# EAGLE schematic sprite (EAGLE 6.6.0)
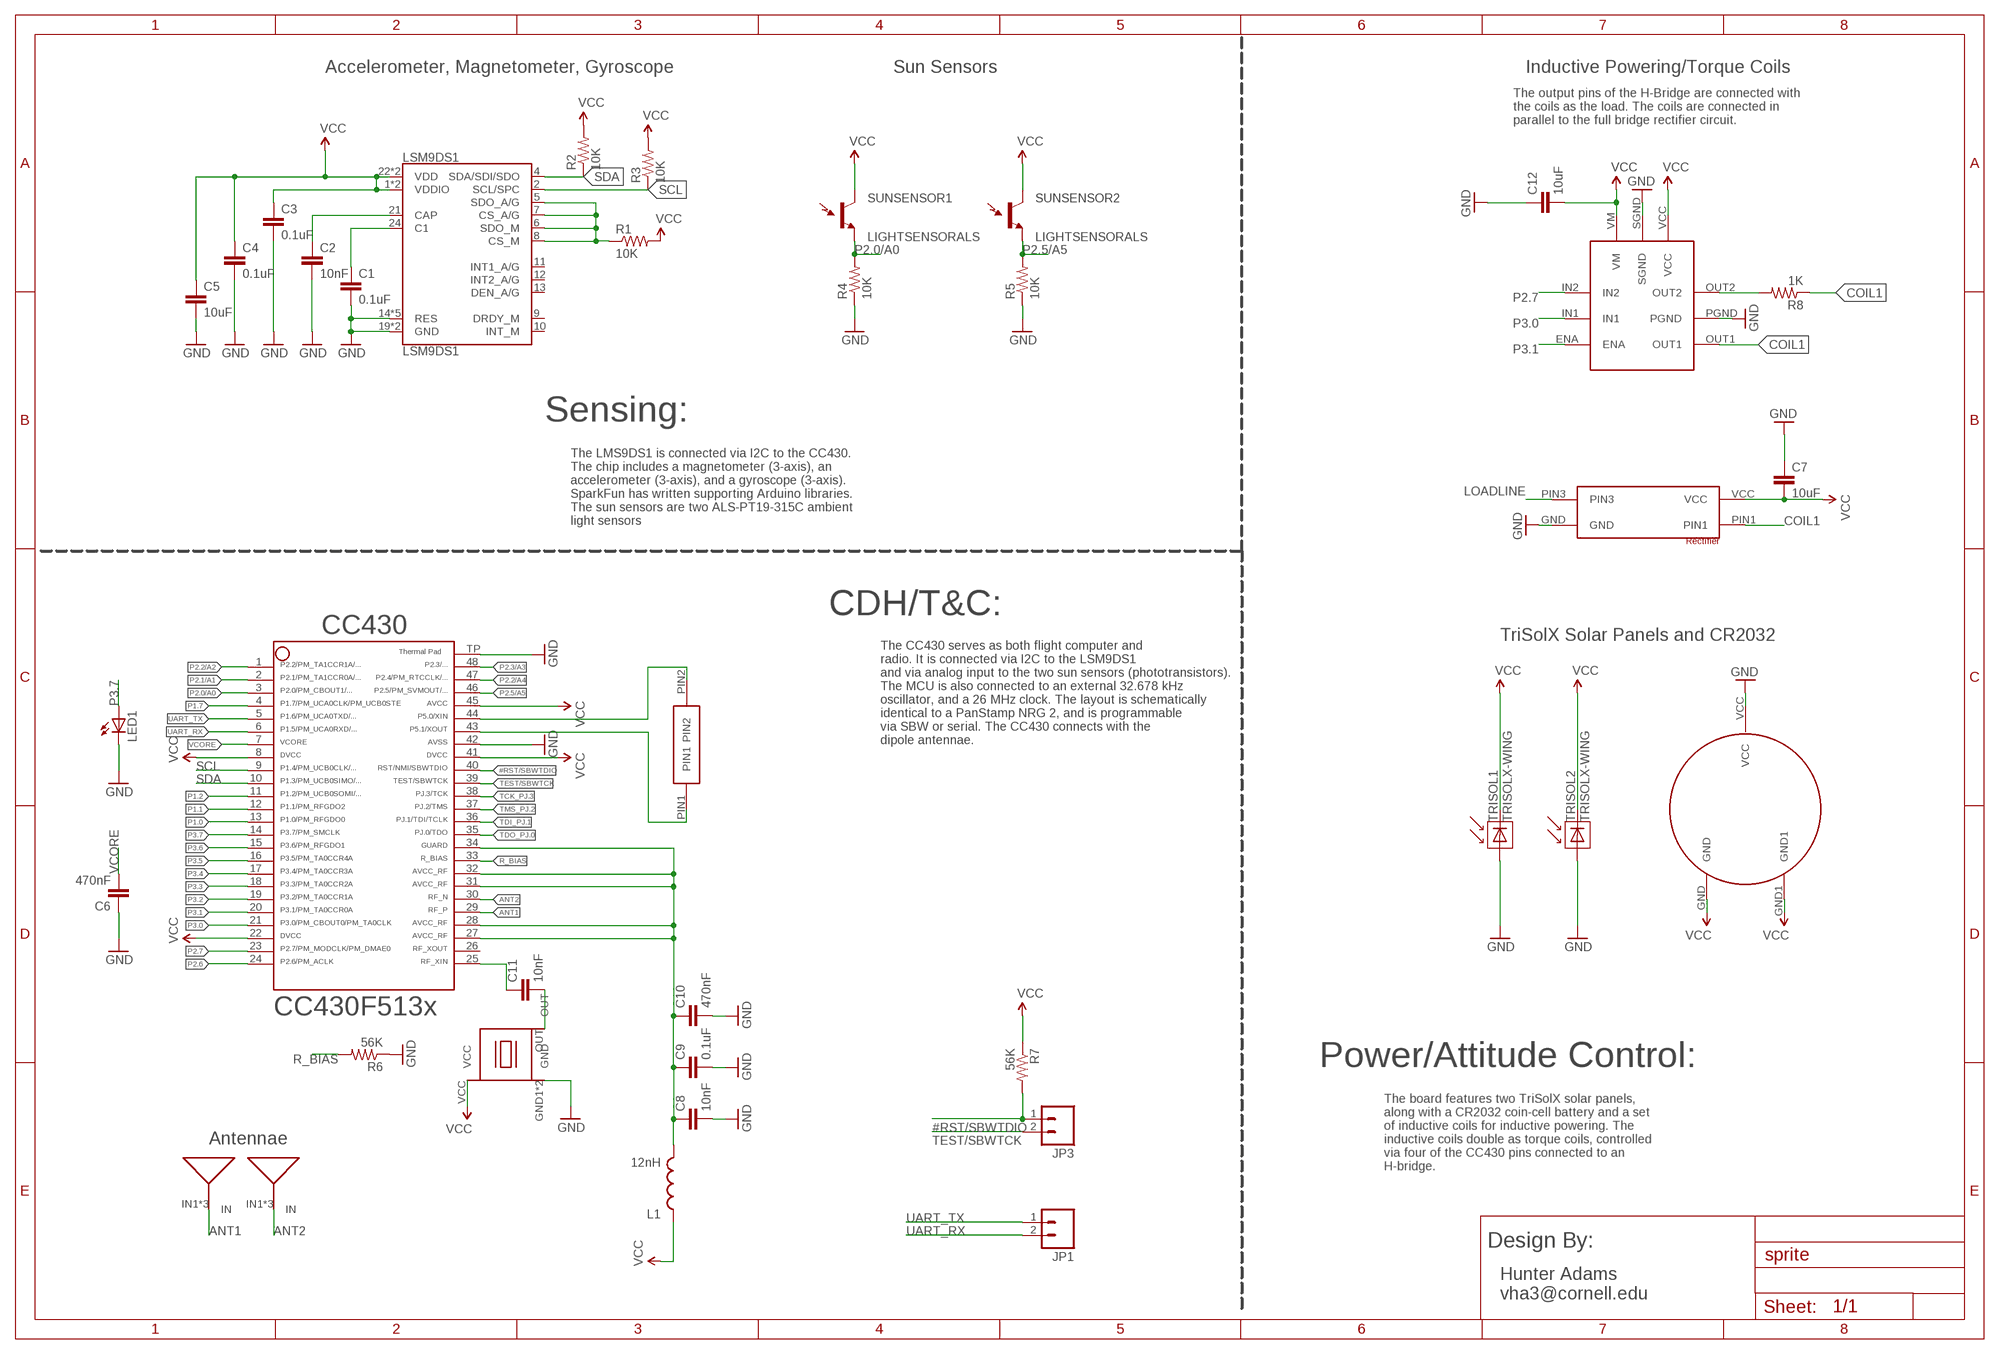
[diagram p0: schematic, sheet 1]

## Parts
32KHZ  SPRITECRYSTALSPRITECRYSTAL  [SPRITECRYSTAL]
ANTENNA1  ANTENNA  [ANTENNA]
ANTENNA2  ANTENNA  [ANTENNA]
C1  0.1uF  CAP0805  [0805]
C2  10nF  CAP0805  [0805]
C3  0.1uF  CAP0805  [0805]
C4  0.1uF  CAP0805  [0805]
C5  10uF  CAP0805  [0805]
C6  470nF  CAP0805  [0805]
C7  10uF  CAP0805  [0805]
C8  10nF  CAP0805  [0805]
C9  0.1uF  CAP0805  [0805]
C10  470nF  CAP0805  [0805]
C11  10nF  CAP0805  [0805]
C12  10uF  CAP0805  [0805]
CC430  CC430F513X---RGZ48  [RGZ48]
H-BRIDGE  LV8417CS  [LV8417CS]
JP1  M02PTH  [1X02]
JP3  M02PTH  [1X02]
L1  12nH  INDUCTOR0402  [C0402]
LED1  LED0603  [LED-0603]
LSM9DS1  LSM9DS1  [LGA24-8X4]
R1  10K  RESISTOR0805-RES  [0805]
R2  10K  RESISTOR0805-RES  [0805]
R3  10K  RESISTOR0805-RES  [0805]
R4  10K  RESISTOR0805-RES  [0805]
R5  10K  RESISTOR0805-RES  [0805]
R6  56K  RESISTOR0805-RES  [0805]
R7  56K  RESISTOR0805-RES  [0805]
R8  1K  RESISTOR0805-RES  [0805]
RECTIFIER  NSR1030QMUTAG  [NSR1030QMUTAG]
SUNSENSOR1  LIGHTSENSORALS  [ALS-PT19]
SUNSENSOR2  LIGHTSENSORALS  [ALS-PT19]
TRISOL1  TRISOLX-WING  [TRISOLX-T01]
TRISOL2  TRISOLX-WING  [TRISOLX-T01]
TXCO  TCXO_7Z  [TXC_7Z]
U$1  CR202  [CR202]

## Nets
#RST/SBWTDIO: CC430.40 JP3.1 R7.2
ANT1: ANTENNA1.IN1(IN) ANTENNA1.IN2(IN) ANTENNA1.IN3(IN) CC430.29
ANT2: ANTENNA2.IN1(IN) ANTENNA2.IN2(IN) ANTENNA2.IN3(IN) CC430.30
COIL1: H-BRIDGE.OUT1 R8.1 RECTIFIER.PIN1
GND: C1.2 C2.2 C3.2 C4.2 C5.2 C6.1 C7.1 C8.2 C9.2 C10.2 C12.1 CC430.42 CC430.TP H-BRIDGE.PGND H-BRIDGE.SGND LED1.C LSM9DS1.14(RES) LSM9DS1.15(RES) LSM9DS1.16(RES) LSM9DS1.17(RES) LSM9DS1.18(RES) LSM9DS1.19(GND) LSM9DS1.20(GND) R4.1 R5.1 R6.1 RECTIFIER.GND TRISOL1.P$3(A) TRISOL2.P$3(A) TXCO.GND1(GND) TXCO.GND2(GND) U$1.VCC
GUARD: C8.1 C9.1 C10.1 CC430.27 CC430.28 CC430.31 CC430.32 CC430.34 L1.2
LOADLINE: H-BRIDGE.OUT2 R8.2 RECTIFIER.PIN3
N$1: C1.1 LSM9DS1.24(C1)
N$2: C2.1 LSM9DS1.21(CAP)
N$3: LSM9DS1.5(SDO_A/G) LSM9DS1.6(SDO_M) LSM9DS1.7(CS_A/G) LSM9DS1.8(CS_M) R1.1
N$4: C11.1 CC430.25
N$5: C11.2 TXCO.OUT
N$7: 32KHZ.PIN2 CC430.44
N$8: 32KHZ.PIN1 CC430.43
P1.0: CC430.13
P1.1: CC430.12
P1.2: CC430.11
P1.7: CC430.4
P2.0/A0: CC430.3 R4.2 SUNSENSOR1.E(E1)
P2.1/A1: CC430.2
P2.2/A2: CC430.1
P2.2/A4: CC430.47
P2.3/A3: CC430.48
P2.5/A5: CC430.46 R5.2 SUNSENSOR2.E(E1)
P2.6: CC430.24
P2.7: CC430.23 H-BRIDGE.IN2
P3.0: CC430.21 H-BRIDGE.IN1
P3.1: CC430.20 H-BRIDGE.ENA
P3.2: CC430.19
P3.3: CC430.18
P3.4: CC430.17
P3.5: CC430.16
P3.6: CC430.15
P3.7: CC430.14 LED1.A
R_BIAS: CC430.33 R6.2
SCL: CC430.9 LSM9DS1.2(SCL/SPC) R3.1
SDA: CC430.10 LSM9DS1.4(SDA/SDI/SDO) R2.1
TCK_PJ.3: CC430.38
TDI_PJ.1: CC430.36
TDO_PJ.0: CC430.35
TEST/SBWTCK: CC430.39 JP3.2
TMS_PJ.2: CC430.37
UART_RX: CC430.6 JP1.2
UART_TX: CC430.5 JP1.1
VCC: C3.1 C4.1 C5.1 C7.2 C12.2 CC430.8 CC430.22 CC430.41 CC430.45 H-BRIDGE.VCC H-BRIDGE.VM L1.1 LSM9DS1.1(VDDIO) LSM9DS1.3(VDDIO) LSM9DS1.22(VDD) LSM9DS1.23(VDD) R1.2 R2.2 R3.2 R7.1 RECTIFIER.VCC SUNSENSOR1.C(C1) SUNSENSOR2.C(C1) TRISOL1.P$2(C) TRISOL2.P$2(C) TXCO.VCC U$1.GND U$1.GND1
VCORE: C6.2 CC430.7
Unconnected: CC430.26 LSM9DS1.9(DRDY_M) LSM9DS1.10(INT_M) LSM9DS1.11(INT1_A/G) LSM9DS1.12(INT2_A/G) LSM9DS1.13(DEN_A/G)

## Notes on the sheet
- Accelerometer, Magnetometer, Gyroscope | Sun Sensors | Inductive Powering/Torque Coils
- The output pins of the H-Bridge are connected with
  the coils as the load. The coils are connected in 
  parallel to the full bridge rectifier circuit.
- Sensing:
- The LMS9DS1 is connected via I2C to the CC430. 
  The chip includes a magnetometer (3-axis), an 
  accelerometer (3-axis), and a gyroscope (3-axis). 
  SparkFun has written supporting Arduino libraries. 
  The sun sensors are two ALS-PT19-315C ambient 
  light sensors
- CDH/T&C:
- TriSolX Solar Panels and CR2032
- The CC430 serves as both flight computer and
  radio. It is connected via I2C to the LSM9DS1 
  and via analog input to the two sun sensors (phototransistors). 
  The MCU is also connected to an external 32.678 kHz 
  oscillator, and a 26 MHz clock. The layout is schematically 
  identical to a PanStamp NRG 2, and is programmable 
  via SBW or serial. The CC430 connects with the 
  dipole antennae.
- Power/Attitude Control:
- Antennae
- The board features two TriSolX solar panels, 
  along with a CR2032 coin-cell battery and a set
  of inductive coils for inductive powering. The 
  inductive coils double as torque coils, controlled 
  via four of the CC430 pins connected to an 
  H-bridge.
- Design By:
- Hunter Adams
  vha3@cornell.edu

## Library data of the parts
32KHZ = SpriteCrystal:SPRITECRYSTAL
ANTENNA1 ANTENNA2 = SpriteAntenna:ANTENNA
C1-C12 = SparkFun:CAP: Capacitor Standard 0603 ceramic capacitor, and 0.1" leaded capacitor.
CC430 = TI_MSP430_v16:CC430F513X---RGZ48: ***CC430F513X***RGZ48 ** ** Rev 1.0 ** 06/2010 * http://focus.ti.com/docs/prod/folders/print/cc430f5137.html
H-BRIDGE = lv8417cs:LV8417CS
JP1 JP3 = SparkFun:M02: Header 2 Standard 2-pin 0.1" header. Use with straight break away headers (SKU : PRT-00116), right angle break away headers (PRT-00553), swiss pins (PRT-00743), machine pins (PRT-00117), and female headers (PRT-00115). Molex polarized connector foot print use with SKU : PRT-08233 with associated crimp pins and housings.
L1 = SparkFun:INDUCTOR: Inductors Basic Inductor/Choke - 0603 and 1206. Footprints are not proven and vary greatly between part numbers.
LED1 = SparkFun:LED: LEDs Standard schematic elements and footprints for 5mm, 3mm, 1206, and 0603 sized LEDs. 5mm - Spark Fun Electronics SKU : COM-00529 (and others)
LSM9DS1 = SparkFun-Sensors:LSM9DS1: LSM9DS1 3D accelerometer, gyroscope & magnetometer The LSM9DS1 is a system-in-package featuring a 3D digital linear acceleration sensor, a 3D digital angular rate sensor, and a 3D digital magnetic sensor. The LSM9DS1 has a linear acceleration full scale of ±2g/±4g/±8/±16 g, a magnetic field full scale of ±4/±8/±12/±16 gauss and an angular rate of ±245/±500/±2000 dps. The LSM9DS1 includes an I2 C serial bus interface supporting standard and fast mode (100 kHz and 400 kHz) and an SPI serial standard interface. Magnetic, accelerometer and gyroscope sensing can be enabled or set in power-down mode separately for smart power management. The LSM9DS1 is available in a plastic land grid array package (LGA) and it is guaranteed to operate over an extended temperature range from -40 °C to +85 °C.; PROD_ID: IC-12536
R1-R8 = SparkFun:RESISTOR: Resistor Basic schematic elements and footprints for 0603, 1206, and PTH resistors.
RECTIFIER = NSR1030QMUTAG:NSR1030QMUTAG
SUNSENSOR1 SUNSENSOR2 = SparkFun-Sensors:LIGHTSENSOR: Ambient Light Sensor Simple light detection sensor. Output varies with light intensity input. Spark Fun Electronics SKU : COM-08348; PROD_ID: IC-11836
TRISOL1 TRISOL2 = TriSolX_QzQube:TRISOLX-WING
TXCO = SpriteTCXO:TCXO_7Z
U$1 = CR202:CR202